# Altium schematic sheet Sche_Clock.SchDoc
size A2
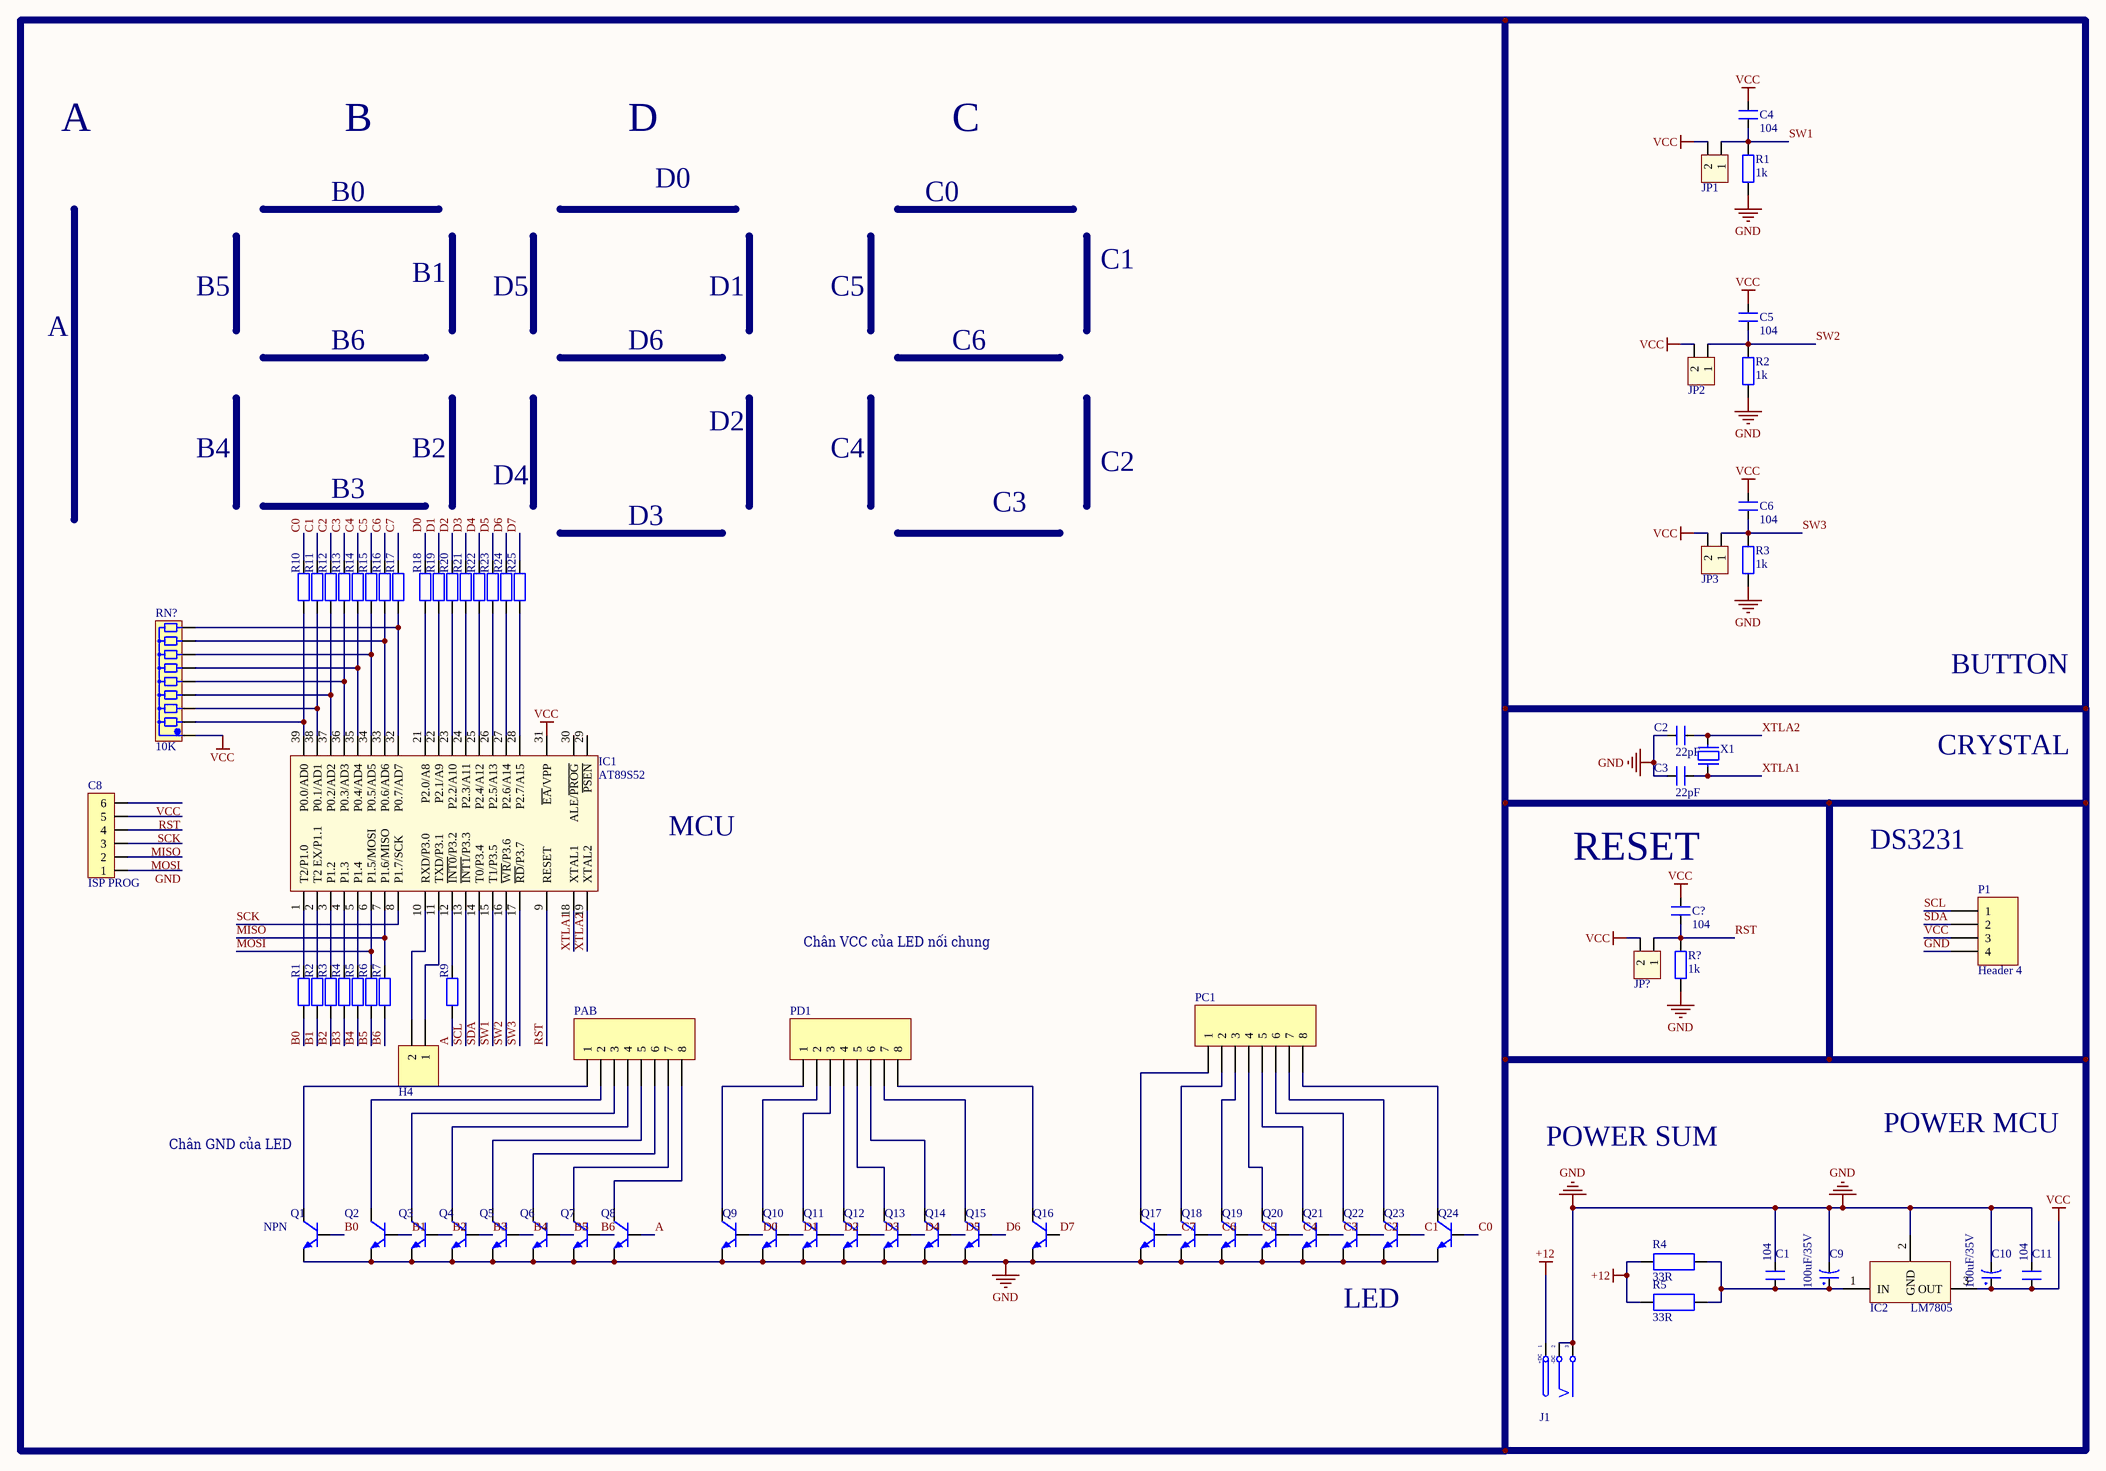
[diagram p0: Sche_Clock.SchDoc]

## Parts
(Parts that share a designator on the sheet are numbered #1, #2 ... from top to bottom, then left to right.)
C1  104  [CN2]
C2  22pF  [CN2]
C3  22pF  [CN2]
C4  104  [CN2]
C5  104  [CN2]
C6  104  [CN2]
C8  ISP PROG  [HDR6]
C9  100uF/35V  [CP1.5/3.4]
C10  100uF/35V  [CP1.5/3.4]
C11  104  [CN2]
C?  104  [CN2]
H4  Header 2  [HDR1X2]  (value not drawn)
IC1  AT89S52  [DIP40/W0.6]
IC2  LM7805  [QTO-220NH]
J1  JACK DC 5MM  [JACK DC 5MM]  (value not drawn)
JP1  JP2  [CON2]  (value not drawn)
JP2  JP2  [CON2]  (value not drawn)
JP3  JP2  [CON2]  (value not drawn)
JP?  JP2  [CON2]  (value not drawn)
P1  Header 4  [HDR1X4]
PAB  Header 8  [HDR1X8]  (value not drawn)
PC1  Header 8  [HDR1X8]  (value not drawn)
PD1  Header 8  [HDR1X8]  (value not drawn)
Q1  NPN  [TRAN-LOWPOWER]
Q2  NPN  [TRAN-LOWPOWER]  (value not drawn)
Q3  NPN  [TRAN-LOWPOWER]  (value not drawn)
Q4  NPN  [TRAN-LOWPOWER]  (value not drawn)
Q5  NPN  [TRAN-LOWPOWER]  (value not drawn)
Q6  NPN  [TRAN-LOWPOWER]  (value not drawn)
Q7  NPN  [TRAN-LOWPOWER]  (value not drawn)
Q8  NPN  [TRAN-LOWPOWER]  (value not drawn)
Q9  NPN  [TRAN-LOWPOWER]  (value not drawn)
Q10  NPN  [TRAN-LOWPOWER]  (value not drawn)
Q11  NPN  [TRAN-LOWPOWER]  (value not drawn)
Q12  NPN  [TRAN-LOWPOWER]  (value not drawn)
Q13  NPN  [TRAN-LOWPOWER]  (value not drawn)
Q14  NPN  [TRAN-LOWPOWER]  (value not drawn)
Q15  NPN  [TRAN-LOWPOWER]  (value not drawn)
Q16  NPN  [TRAN-LOWPOWER]  (value not drawn)
Q17  NPN  [TRAN-LOWPOWER]  (value not drawn)
Q18  NPN  [TRAN-LOWPOWER]  (value not drawn)
Q19  NPN  [TRAN-LOWPOWER]  (value not drawn)
Q20  NPN  [TRAN-LOWPOWER]  (value not drawn)
Q21  NPN  [TRAN-LOWPOWER]  (value not drawn)
Q22  NPN  [TRAN-LOWPOWER]  (value not drawn)
Q23  NPN  [TRAN-LOWPOWER]  (value not drawn)
Q24  NPN  [TRAN-LOWPOWER]  (value not drawn)
R1#1  1k  [R1/4W]
R1#2  1k  [R1/4W]  (value not drawn)
R2#1  1k  [R1/4W]
R2#2  1k  [R1/4W]  (value not drawn)
R3#1  1k  [R1/4W]
R3#2  1k  [R1/4W]  (value not drawn)
R4#1  1k  [R1/4W]  (value not drawn)
R4#2  33R  [R2W]
R5#1  1k  [R1/4W]  (value not drawn)
R5#2  33R  [R2W]
R6  1k  [R1/4W]  (value not drawn)
R7  1k  [R1/4W]  (value not drawn)
R9  1k  [R1/4W]  (value not drawn)
R10  1k  [R1/4W]  (value not drawn)
R11  1k  [R1/4W]  (value not drawn)
R12  1k  [R1/4W]  (value not drawn)
R13  1k  [R1/4W]  (value not drawn)
R14  1k  [R1/4W]  (value not drawn)
R15  1k  [R1/4W]  (value not drawn)
R16  1k  [R1/4W]  (value not drawn)
R17  1k  [R1/4W]  (value not drawn)
R18  1k  [R1/4W]  (value not drawn)
R19  1k  [R1/4W]  (value not drawn)
R20  1k  [R1/4W]  (value not drawn)
R21  1k  [R1/4W]  (value not drawn)
R22  1k  [R1/4W]  (value not drawn)
R23  1k  [R1/4W]  (value not drawn)
R24  1k  [R1/4W]  (value not drawn)
R25  1k  [R1/4W]  (value not drawn)
R?  1k  [R1/4W]
RN?  10K  [RN8]
X1  12Mhz  [XT2]  (value not drawn)

## Nets
+12: J1.1(T) R4#2.1 R5#2.1
GND: C1.2 C2.1 C3.1 C8.1 C9.2 C10.2 C11.2 IC1.20(GND) IC2.2(GND) J1.2(TN) J1.3(S) P1.4 Q1.1(E) Q2.1(E) Q3.1(E) Q4.1(E) Q5.1(E) Q6.1(E) Q7.1(E) Q8.1(E) Q9.1(E) Q10.1(E) Q11.1(E) Q12.1(E) Q13.1(E) Q14.1(E) Q15.1(E) Q16.1(E) Q17.1(E) Q18.1(E) Q19.1(E) Q20.1(E) Q21.1(E) Q22.1(E) Q23.1(E) Q24.1(E) R1#1.1 R2#1.1 R3#1.1 R?.1
VCC: C4.1 C5.1 C6.1 C8.6 C10.1 C11.1 C?.1 IC1.31(~{EA}/VPP) IC1.40(VCC) IC2.3(OUT) JP1.2 JP2.2 JP3.2 JP?.2 P1.3 RN?.1
A: Q8.3(B) R9.1
B0: Q1.3(B) R1#2.1
B1: Q2.3(B) R2#2.1
B2: Q3.3(B) R3#2.1
B3: Q4.3(B) R4#1.1
B4: Q5.3(B) R5#1.1
B5: Q6.3(B) R6.1
B6: Q7.3(B) R7.1
C0: Q24.3(B) R10.2
C1: Q23.3(B) R11.2
C2: Q22.3(B) R12.2
C3: Q21.3(B) R13.2
C4: Q20.3(B) R14.2
C5: Q19.3(B) R15.2
C6: Q18.3(B) R16.2
C7: Q17.3(B) R17.2
D0: Q9.3(B) R18.2
D1: Q10.3(B) R19.2
D2: Q11.3(B) R20.2
D3: Q12.3(B) R21.2
D4: Q13.3(B) R22.2
D5: Q14.3(B) R23.2
D6: Q15.3(B) R24.2
D7: Q16.3(B) R25.2
MISO: C8.3 IC1.7(P1.6/MISO) R7.2
MOSI: C8.2 IC1.6(P1.5/MOSI) R6.2
RST: C8.5 C?.2 IC1.9(RESET) JP?.1 R?.2
SCK: C8.4 IC1.8(P1.7/SCK)
SCL: IC1.13(~{INT1}/P3.3) P1.1
SDA: IC1.14(T0/P3.4) P1.2
SW1: C4.2 IC1.15(T1/P3.5) JP1.1 R1#1.2
SW2: C5.2 IC1.16(~{WR}/P3.6) JP2.1 R2#1.2
SW3: C6.2 IC1.17(~{RD}/P3.7) JP3.1 R3#1.2
XTLA1: C3.2 IC1.18(XTAL1) X1.1
XTLA2: C2.2 IC1.19(XTAL2) X1.2
NetC1_1: C1.1 C9.1 IC2.1(IN) R4#2.2 R5#2.2
NetH4_1: H4.1 IC1.11(TXD/P3.1)
NetH4_2: H4.2 IC1.10(RXD/P3.0)
NetIC1_1: IC1.1(T2/P1.0) R1#2.2
NetIC1_2: IC1.2(T2_EX/P1.1) R2#2.2
NetIC1_3: IC1.3(P1.2) R3#2.2
NetIC1_4: IC1.4(P1.3) R4#1.2
NetIC1_5: IC1.5(P1.4) R5#1.2
NetIC1_12: IC1.12(~{INT0}/P3.2) R9.2
NetIC1_21: IC1.21(P2.0/A8) R18.1
NetIC1_22: IC1.22(P2.1/A9) R19.1
NetIC1_23: IC1.23(P2.2/A10) R20.1
NetIC1_24: IC1.24(P2.3/A11) R21.1
NetIC1_25: IC1.25(P2.4/A12) R22.1
NetIC1_26: IC1.26(P2.5/A13) R23.1
NetIC1_27: IC1.27(P2.6/A14) R24.1
NetIC1_28: IC1.28(P2.7/A15) R25.1
NetIC1_32: IC1.32(P0.7/AD7) R17.1 RN?.9
NetIC1_33: IC1.33(P0.6/AD6) R16.1 RN?.8
NetIC1_34: IC1.34(P0.5/AD5) R15.1 RN?.7
NetIC1_35: IC1.35(P0.4/AD4) R14.1 RN?.6
NetIC1_36: IC1.36(P0.3/AD3) R13.1 RN?.5
NetIC1_37: IC1.37(P0.2/AD2) R12.1 RN?.4
NetIC1_38: IC1.38(P0.1/AD1) R11.1 RN?.3
NetIC1_39: IC1.39(P0.0/AD0) R10.1 RN?.2
NetPAB_1: PAB.1 Q1.2(C)
NetPAB_2: PAB.2 Q2.2(C)
NetPAB_3: PAB.3 Q3.2(C)
NetPAB_4: PAB.4 Q4.2(C)
NetPAB_5: PAB.5 Q5.2(C)
NetPAB_6: PAB.6 Q6.2(C)
NetPAB_7: PAB.7 Q7.2(C)
NetPAB_8: PAB.8 Q8.2(C)
NetPC1_1: PC1.1 Q17.2(C)
NetPC1_2: PC1.2 Q18.2(C)
NetPC1_3: PC1.3 Q19.2(C)
NetPC1_4: PC1.4 Q20.2(C)
NetPC1_5: PC1.5 Q21.2(C)
NetPC1_6: PC1.6 Q22.2(C)
NetPC1_7: PC1.7 Q23.2(C)
NetPC1_8: PC1.8 Q24.2(C)
NetPD1_1: PD1.1 Q9.2(C)
NetPD1_2: PD1.2 Q10.2(C)
NetPD1_3: PD1.3 Q11.2(C)
NetPD1_4: PD1.4 Q12.2(C)
NetPD1_5: PD1.5 Q13.2(C)
NetPD1_6: PD1.6 Q14.2(C)
NetPD1_7: PD1.7 Q15.2(C)
NetPD1_8: PD1.8 Q16.2(C)

Not connected (* = marked no-connect by the designer): IC1 29(~{PSEN}) 30(ALE/~{PROG})

## Notes on the sheet
- A
- B
- D
- C
- B0
- D0
- C0
- B5
- B1
- D5
- D1
- C5
- C1
- B6
- D6
- C6
- D2
- B4
- B3
- B2
- D4
- C4
- C2
- D3
- C3
- BUTTON
- CRYSTAL
- MCU
- RESET
- DS3231
- Chân VCC của LED nối chung
- Chân GND của LED
- POWER SUM
- POWER MCU
- LED
- (in symbol JACK DC 5MM) +DC; -DC

## Library data of the parts
C1-C6 C11 C? = CN2: Cap np 104 => 105pF; Value: 0.1uF
C8 = Header6: Header IDC, 6 x 1 Pin Vertical 2.54mm Pitch (Non-Boxed, Male); Manufacturer: W¨¹rth Elektronik eiSos GmbH; partNo: 613002143121; ComponentLink1 Description: Manufacturer; ComponentLink2 Description: Datasheet; NoPins: 02; Created Date: 29 March 2013; ComponentLink1URL: http://www.we-online.com; ComponentLink2URL: http://katalog.we-online.de/em/datasheet/6130xx143121.pdf; Created by: Karrer Zheng
C9 C10 = CP3: Cap 100uF/35V - 470uF/16V; Value: 100uF/35V/50V; Description 1: 1000uF/6,3V - 470uF/16V - 330uF - 25V; Description 2: 220uF/35V - 100uF/50V - 63V - 4,7uF/200V; Description 3: 22uF => 33uF100V - 3,3uF => 4,7uF/250V; Description 4: 2,2uF =>3,3uF/350 - 2,2uF/400V - 1uF/450V
H4 = Header 2: Header, 2-Pin; LatestRevisionDate: 17-Jul-2002; LatestRevisionNote: Re-released for DXP Platform.; Publisher: Altium Limited
IC1 = AT89S52: AT89S52, 8k Byte Flash Memory , 40 Pin; Value: AT89S52
IC2 = LM78xx: On ap +, from + 5 to + 24VDC; Value: LM7805
JP1-JP3 JP? = Con2: Connector 2; Value: Connector 2
P1 = Header 4: Header, 4-Pin; LatestRevisionDate: 17-Jul-2002; LatestRevisionNote: Re-released for DXP Platform.; Publisher: Altium Limited
PAB PC1 PD1 = Header 8: Header, 8-Pin; LatestRevisionDate: 17-Jul-2002; LatestRevisionNote: Re-released for DXP Platform.; Publisher: Altium Limited
Q1-Q24 = NPN: NPN General; Published: 8-Jun-2000; LatestRevisionDate: 15-Jan-2003; LatestRevisionNote: PCB Footprint 'BCY-W3/D4.7' replaced; DatasheetDocument: 1997; PackageDocument: Sep-1998; PackageReference: TO-92A; Publisher: Altium Limited; Code_JEDEC: TO-92A; ComponentLink1Description: Manufacturer Link; ComponentLink1URL: http://www.fairchildsemi.com/; ComponentLink2Description: Datasheet; ComponentLink2URL: http://www.fairchildsemi.com/ds/2N%2F2N3904.pdf
R1#1 R1#2 R2#1 R2#2 R3#1 R3#2 R4#1 R5#1 R6 R7 R9-R25 R? = R1/4W: Resistor 1/4W; Value: R1/4W - 1K
R4#2 R5#2 = R2W: Resistor 2W; Value: R2W - 47
RN? = RN8: Resistor 8 (Thanh); Value: Tro thanh 10K
X1 = XT2: Crystal, 32.768 KHz, -40 to 85 degC, 3.2 x 1.5 x 0.9 mm SMD; Value: 4Mhz